# Altium schematic sheet P1.schdoc
size 297 x 209 mm; Symbol: Drawing-Symbol_A4; @Project Name: 2.54_2x8; @Page Count: 1; @Update Date: 2026-08-08; @Create Date: 2026-08-08; @Schematic Name: Schematic1; @Page No: 1; @Page Name: P1; Company: EasyEDA.com; Version: V1.0; Page Size: A4; Device: Drawing-Symbol_A4; @Create Time: 15:33:18; @Update Time: 15:33:18; Border: 1; Width: 1170; Height: 825; Region Start: 1; X Region Count: 6; Y Region Count: 4; Blade Width: 10; Title Block Position: 3; @Board Name: Board1
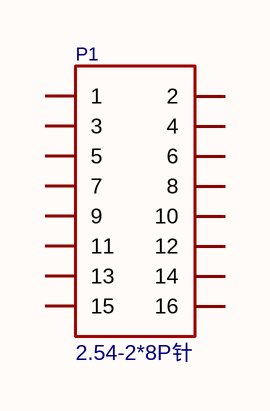
[diagram p0: P1.schdoc]

## Parts
P1  2.54-2*8P针  [HDR-TH_16P-P2.54-V-M-R2-C8-S2.54]

## Nets

Not connected (* = marked no-connect by the designer): P1 1 2 3 4 5 6 7 8 9 10 11 12 13 14 15 16

## Notes on the sheet
- Create at
- 2026-08-08
- Schematic
- Board
- Schematic1
- Board1
- Update at
- Page
- P1
- Drawn
- Reviewed
- 2.54_2x8
- Version
- V1.0
- Size
- A4
- Page  1  Total  1
- EasyEDA.com

## Library data of the parts
P1 = 2.54-2*8P针_C68234: Pin Structure:2x8P Pitch:2.54mm Row Spacing:2.54mm Circluar Pins/Square Pins:Pin Header Mounting Type:Through Hole Number of Rows:2 Number of Pins:16P Current Rating:3A Voltage Rating (Max):- Length of Mating Pin:5.9mm Insulation Height:2.54mm Length of E; Manufacturer: BOOMELE(博穆精密); Symbol: Header-Male-2.54_2x8; AddInBom: yes; ModelId: e9bbe0154d6648aeb599214ae56f69990819f05c4eef4c71ace90d822a990e87; ModelName: HDR2.54-M-LI-2X8P; ModelTransform: 799.99844,200,0,0,0,0,0,0,-118.11; Pin Structure: 2x8P; Pitch: 2.54mm; Current Rating: 3A; Device: 2.54-2*8P针_C68234; Supplier: LCSC; Manufacturer Part: 2.54-2*8P针; Supplier Part: C68234; JLCPCB Part Class: Extended Part; LCSC Part Name: 2x8P 间距:2.54mm 方针 直插; Supplier Footprint: 插件,P=2.54mm; Datasheet: https://item.szlcsc.com/datasheet/2.54-2*8P%25E9%2592%2588/69336.html; ConvertToPcb: yes; FootprintName: HDR-TH_16P-P2.54-V-M-R2-C8-S2.54; Row Spacing: 2.54mm; Circluar Pins/Square Pins: Pin Header; Mounting Type: Through Hole; Number of Rows: 2; Number of Pins: 16P; Voltage Rating (Max): -; Length of Mating Pin: 5.9mm; Insulation Height: 2.54mm; Length of End Connection Pin: 3mm; Contact Material: Brass; Contact Plating: Gold; Operating Temperature: -55℃~+105℃; Color: Black